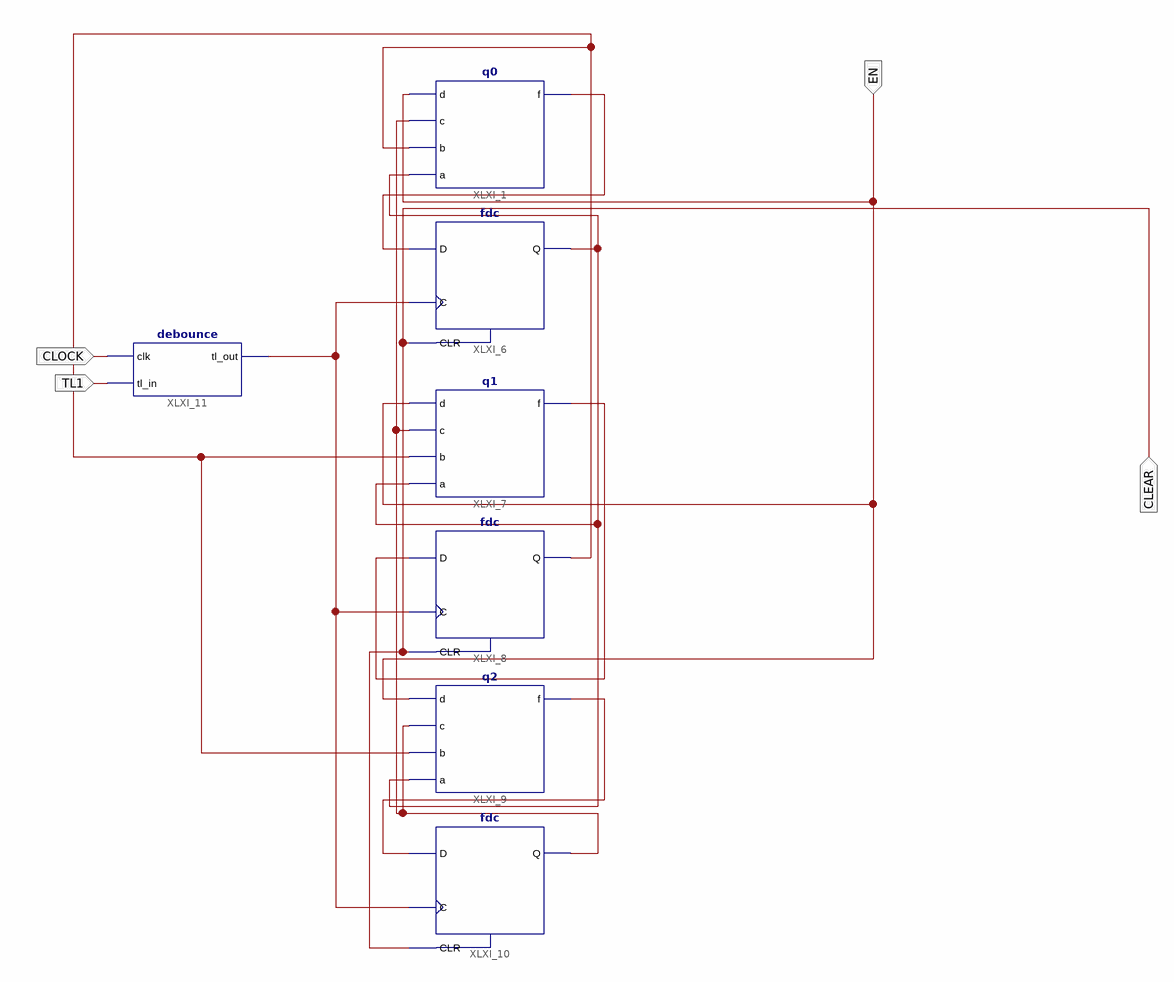
[diagram p0: schematic sheet 1]
// Xilinx ISE schematic nasob.sch (spartan3e) as structural Verilog: 7 symbols, 4 ports
module nasob (
  input  EN,
  input  CLEAR,
  input  CLOCK,
  input  TL1
);

  wire XLXN_2, XLXN_5, XLXN_7, XLXN_9, XLXN_11, XLXN_16, XLXN_18;

  q0 XLXI_1 (.d(EN), .c(XLXN_18), .b(XLXN_16), .a(XLXN_11), .f(XLXN_5));
  fdc XLXI_6 (.C(XLXN_2), .CLR(CLEAR), .D(XLXN_5), .Q(XLXN_11));
  q1 XLXI_7 (.d(EN), .c(XLXN_18), .b(XLXN_16), .a(XLXN_11), .f(XLXN_7));
  fdc XLXI_8 (.C(XLXN_2), .CLR(CLEAR), .D(XLXN_7), .Q(XLXN_16));
  q2 XLXI_9 (.d(EN), .c(XLXN_18), .b(XLXN_16), .a(XLXN_11), .f(XLXN_9));
  fdc XLXI_10 (.C(XLXN_2), .CLR(CLEAR), .D(XLXN_9), .Q(XLXN_18));
  debounce XLXI_11 (.clk(CLOCK), .tl_in(TL1), .tl_out(XLXN_2));
endmodule
